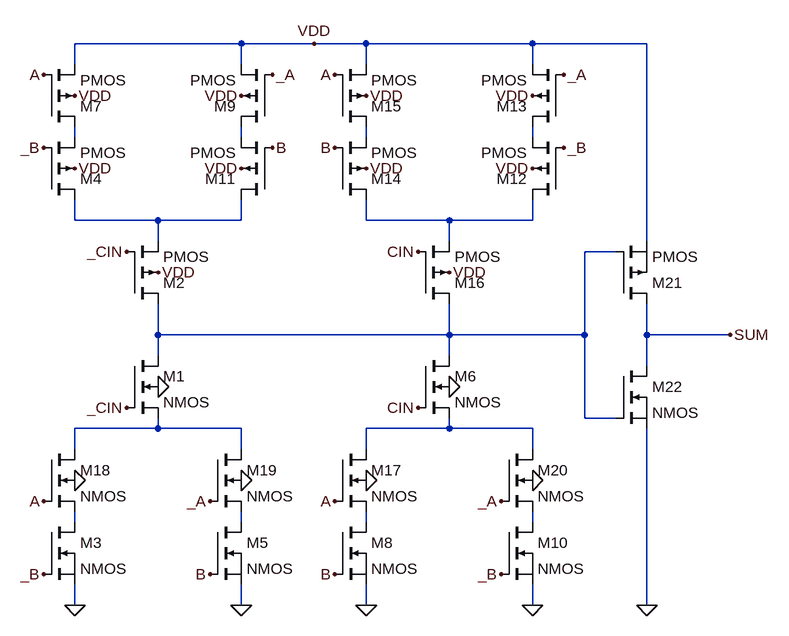
[diagram p0: schematic SUM.asc]
SUM.asc, the LTspice schematic file:
Version 4
SHEET 1 964 680
WIRE 144 -592 -112 -592
WIRE 256 -592 144 -592
WIRE 336 -592 256 -592
WIRE 592 -592 336 -592
WIRE 768 -592 592 -592
WIRE -112 -560 -112 -592
WIRE 144 -560 144 -592
WIRE 336 -560 336 -592
WIRE 592 -560 592 -592
WIRE -112 -448 -112 -464
WIRE 144 -448 144 -464
WIRE 336 -448 336 -464
WIRE 592 -448 592 -464
WIRE -112 -320 -112 -352
WIRE 16 -320 -112 -320
WIRE 144 -320 144 -352
WIRE 144 -320 16 -320
WIRE 336 -320 336 -352
WIRE 464 -320 336 -320
WIRE 592 -320 592 -352
WIRE 592 -320 464 -320
WIRE 16 -288 16 -320
WIRE 464 -288 464 -320
WIRE 768 -288 768 -592
WIRE 720 -272 672 -272
WIRE 16 -144 16 -192
WIRE 464 -144 464 -192
WIRE 464 -144 16 -144
WIRE 672 -144 672 -272
WIRE 672 -144 464 -144
WIRE 768 -144 768 -192
WIRE 896 -144 768 -144
WIRE 16 -112 16 -144
WIRE 464 -112 464 -144
WIRE 768 -96 768 -144
WIRE 672 -16 672 -144
WIRE 720 -16 672 -16
WIRE 16 0 16 -16
WIRE 16 0 -112 0
WIRE 144 0 16 0
WIRE 464 0 464 -16
WIRE 464 0 336 0
WIRE 592 0 464 0
WIRE -112 32 -112 0
WIRE 144 32 144 0
WIRE 336 32 336 0
WIRE 592 32 592 0
WIRE -112 144 -112 128
WIRE 144 144 144 128
WIRE 336 144 336 128
WIRE 592 144 592 128
WIRE -112 272 -112 240
WIRE 144 272 144 240
WIRE 336 272 336 240
WIRE 592 272 592 240
WIRE 768 272 768 0
FLAG -112 272 0
FLAG 144 272 0
FLAG 336 272 0
FLAG 592 272 0
FLAG 768 272 0
FLAG 896 -144 SUM
FLAG 256 -592 VDD
FLAG -160 -544 A
FLAG 288 -544 A
FLAG -160 112 A
FLAG 288 112 A
FLAG 192 -544 _A
FLAG 640 -544 _A
FLAG 96 112 _A
FLAG 544 112 _A
FLAG 192 -432 B
FLAG 288 -432 B
FLAG 288 224 B
FLAG 96 224 B
FLAG -160 -432 _B
FLAG 640 -432 _B
FLAG 544 224 _B
FLAG -160 224 _B
FLAG 416 -272 CIN
FLAG 416 -32 CIN
FLAG -32 -272 _CIN
FLAG -32 -32 _CIN
FLAG 144 80 0
FLAG -112 80 0
FLAG 336 80 0
FLAG 592 80 0
FLAG 464 -64 0
FLAG 16 -64 0
FLAG 464 -240 VDD
FLAG 592 -400 VDD
FLAG 592 -512 VDD
FLAG 336 -512 VDD
FLAG 336 -400 VDD
FLAG 144 -512 VDD
FLAG 144 -400 VDD
FLAG -112 -512 VDD
FLAG -112 -400 VDD
FLAG 16 -240 VDD
SYMBOL nmos -160 144 R0
SYMATTR InstName M3
SYMBOL nmos 96 144 R0
SYMATTR InstName M5
SYMBOL nmos 288 144 R0
SYMATTR InstName M8
SYMBOL nmos 544 144 R0
SYMATTR InstName M10
SYMBOL pmos 720 -192 M180
SYMATTR InstName M21
SYMBOL nmos 720 -96 R0
SYMATTR InstName M22
SYMBOL pmos4 -32 -192 M180
SYMATTR InstName M2
SYMBOL pmos4 -160 -352 M180
SYMATTR InstName M4
SYMBOL pmos4 -160 -464 M180
SYMATTR InstName M7
SYMBOL pmos4 192 -464 R180
SYMATTR InstName M9
SYMBOL pmos4 192 -352 R180
SYMATTR InstName M11
SYMBOL pmos4 640 -352 R180
SYMATTR InstName M12
SYMBOL pmos4 640 -464 R180
SYMATTR InstName M13
SYMBOL pmos4 288 -352 M180
SYMATTR InstName M14
SYMBOL pmos4 288 -464 M180
SYMATTR InstName M15
SYMBOL pmos4 416 -192 M180
SYMATTR InstName M16
SYMBOL nmos4 -32 -112 R0
SYMATTR InstName M1
SYMBOL nmos4 416 -112 R0
SYMATTR InstName M6
SYMBOL nmos4 288 32 R0
SYMATTR InstName M17
SYMBOL nmos4 -160 32 R0
SYMATTR InstName M18
SYMBOL nmos4 96 32 R0
SYMATTR InstName M19
SYMBOL nmos4 544 32 R0
SYMATTR InstName M20

The netlist it stands for:
* SUM.asc
M3 N010 _B 0 0 NMOS
M5 N011 B 0 0 NMOS
M8 N012 B 0 0 NMOS
M10 N013 _B 0 0 NMOS
M21 SUM N007 VDD VDD PMOS
M22 SUM N007 0 0 NMOS
M2 N007 _CIN N005 VDD PMOS
M4 N005 _B N001 VDD PMOS
M7 N001 A VDD VDD PMOS
M9 N002 _A VDD VDD PMOS
M11 N005 B N002 VDD PMOS
M12 N006 _B N004 VDD PMOS
M13 N004 _A VDD VDD PMOS
M14 N006 B N003 VDD PMOS
M15 N003 A VDD VDD PMOS
M16 N007 CIN N006 VDD PMOS
M1 N007 _CIN N008 0 NMOS
M6 N007 CIN N009 0 NMOS
M17 N009 A N012 0 NMOS
M18 N008 A N010 0 NMOS
M19 N008 _A N011 0 NMOS
M20 N009 _A N013 0 NMOS
.model NMOS NMOS
.model PMOS PMOS
.lib standard.mos
.backanno
.end